# EAGLE schematic fitness logger (EAGLE 6.4)
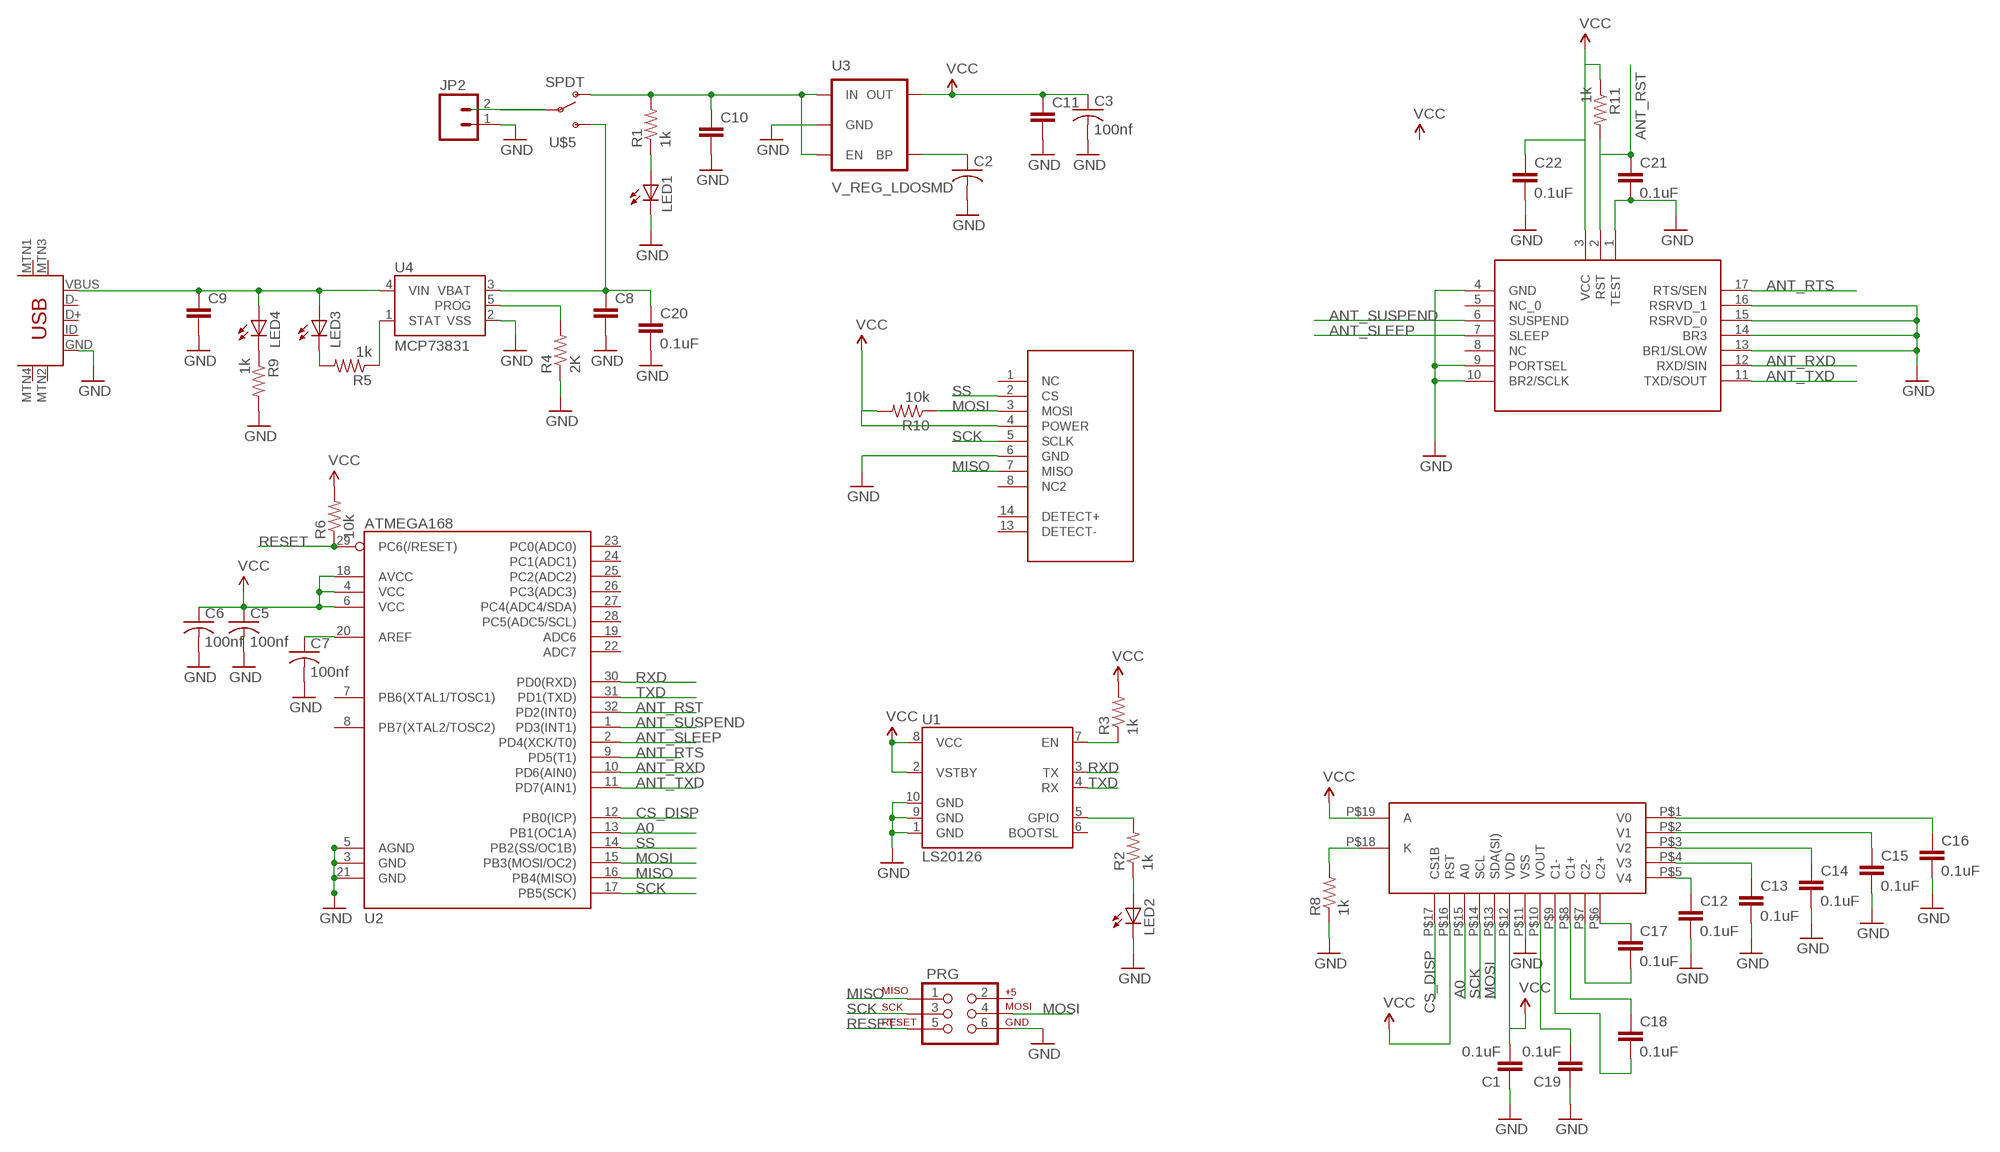
[diagram p0: schematic, sheet 1]

## Parts
C1  0.1uF  0.1UF-25V(+80/-20%)(0603)  [0402-CAP]
C2  C-USC0603  [C0603]
C3  100nf  C-USC0603  [C0603]
C5  100nf  C-USC0603  [C0603]
C6  100nf  C-USC0603  [C0603]
C7  100nf  C-USC0603  [C0603]
C8  CAP1210  [1210]
C9  CAP1210  [1210]
C10  CAP1210  [1210]
C11  CAP1210  [1210]
C12  0.1uF  0.1UF-25V(+80/-20%)(0603)  [0402-CAP]
C13  0.1uF  0.1UF-25V(+80/-20%)(0603)  [0402-CAP]
C14  0.1uF  0.1UF-25V(+80/-20%)(0603)  [0402-CAP]
C15  0.1uF  0.1UF-25V(+80/-20%)(0603)  [0402-CAP]
C16  0.1uF  0.1UF-25V(+80/-20%)(0603)  [0402-CAP]
C17  0.1uF  0.1UF-25V(+80/-20%)(0603)  [0402-CAP]
C18  0.1uF  0.1UF-25V(+80/-20%)(0603)  [0402-CAP]
C19  0.1uF  0.1UF-25V(+80/-20%)(0603)  [0402-CAP]
C20  0.1uF  0.1UF-25V(+80/-20%)(0603)  [0402-CAP]
C21  0.1uF  0.1UF-25V(+80/-20%)(0603)  [0402-CAP]
C22  0.1uF  0.1UF-25V(+80/-20%)(0603)  [0402-CAP]
JP2  M02PTH3  [1X02_LONGPADS]
LED1  LEDCHIPLED_0603  [CHIPLED_0603]
LED2  LEDCHIPLED_0603  [CHIPLED_0603]
LED3  LEDCHIPLED_0603  [CHIPLED_0603]
LED4  LEDCHIPLED_0603  [CHIPLED_0603]
PRG  AVR_SPI_PRG_6PTH  [2X3]
R1  1k  RESISTOR0603-RES  [0603-RES]
R2  1k  RESISTOR0603-RES  [0603-RES]
R3  1k  RESISTOR0603-RES  [0603-RES]
R4  2K  RESISTOR0603-RES  [0603-RES]
R5  1k  RESISTOR0603-RES  [0603-RES]
R6  10k  RESISTOR0603-RES  [0603-RES]
R8  1k  RESISTOR0603-RES  [0603-RES]
R9  1k  RESISTOR0603-RES  [0603-RES]
R10  10k  RESISTOR0603-RES  [0603-RES]
R11  1k  RESISTOR0603-RES  [0603-RES]
U1  LS20126  [LS20126]
U2  ATMEGA168  [TQFP32-08]
U3  V_REG_LDOSMD  [SOT23-5]
U4  MCP73831  [SOT23-5]
U$1  USB-MINIB-5PIN  [USB-MINIB]
U$2  ANTAP281M4IB  [ANTAP281M4IB]
U$3  NHD-C12832A1Z  [NHD-C12832A1Z]
U$4  MICRO_SD  [MICRO_SD_MOLEX]
U$5  SPDT  [SPDT-SMD]

## Nets
A0: U2.13(PB1(OC1A)) U$3.P$15(A0)
ANT_RST: C21.1 R11.2 U2.32(PD2(INT0)) U$2.2(RST)
ANT_RTS: U2.9(PD5(T1)) U$2.17(RTS/SEN)
ANT_RXD: U2.10(PD6(AIN0)) U$2.12(RXD/SIN)
ANT_SLEEP: U2.2(PD4(XCK/T0)) U$2.7(SLEEP)
ANT_SUSPEND: U2.1(PD3(INT1)) U$2.6(SUSPEND)
ANT_TXD: U2.11(PD7(AIN1)) U$2.11(TXD/SOUT)
CS_DISP: U2.12(PB0(ICP)) U$3.P$17(CS1B)
GND: C1.1 C2.2 C3.2 C5.2 C6.2 C7.2 C8.2 C9.2 C10.2 C11.2 C12.2 C13.2 C14.2 C15.2 C16.2 C19.1 C20.2 C21.2 C22.2 JP2.1 LED1.C LED2.C PRG.6 R4.1 R8.1 R9.2 U1.1(GND) U1.9(GND) U1.10(GND) U2.3(GND) U2.5(AGND) U2.21(GND) U3.2(GND) U4.2(VSS) U$1.GND U$2.1(TEST) U$2.4(GND) U$2.9(PORTSEL) U$2.10(BR2/SCLK) U$2.13(BR1/SLOW) U$2.14(BR3) U$2.15(RSRVD_0) U$2.16(RSRVD_1) U$3.P$11(VSS) U$4.6(GND)
MISO: PRG.1 U2.16(PB4(MISO)) U$4.7(MISO)
MOSI: PRG.4 R10.1 U2.15(PB3(MOSI/OC2)) U$3.P$13(SDA(SI)) U$4.3(MOSI)
N$1: C10.1 R1.2 U3.1(IN) U3.3(EN) U$5.1(O) U$5.4(O)
N$2: C2.1 U3.4(BP)
N$3: LED1.A R1.1
N$4: C9.1 LED3.A LED4.A U4.4(VIN) U$1.VBUS
N$5: LED2.A R2.1
N$6: R2.2 U1.5(GPIO)
N$7: JP2.2 U$5.2(P) U$5.5(P)
N$8: C8.1 C20.1 U4.3(VBAT) U$5.3(S) U$5.6(S)
N$9: R3.1 U1.7(EN)
N$11: R4.2 U4.5(PROG)
N$12: C7.1 U2.20(AREF)
N$13: LED3.C R5.2
N$14: R5.1 U4.1(STAT)
N$15: C12.1 U$3.P$5(V4)
N$16: C13.1 U$3.P$4(V3)
N$17: C14.1 U$3.P$3(V2)
N$18: C15.1 U$3.P$2(V1)
N$19: C16.1 U$3.P$1(V0)
N$20: C17.1 U$3.P$6(C2+)
N$21: C17.2 U$3.P$7(C2-)
N$22: C19.2 U$3.P$10(VOUT)
N$23: C18.1 U$3.P$8(C1+)
N$24: R8.2 U$3.P$18(K)
N$25: C18.2 U$3.P$9(C1-)
N$26: LED4.C R9.1
RESET: PRG.5 R6.1 U2.29(PC6(/RESET))
RXD: U1.3(TX) U2.30(PD0(RXD))
SCK: PRG.3 U2.17(PB5(SCK)) U$3.P$14(SCL) U$4.5(SCLK)
SS: U2.14(PB2(SS/OC1B)) U$4.2(CS)
TXD: U1.4(RX) U2.31(PD1(TXD))
VCC: C1.2 C3.1 C5.1 C6.1 C11.1 C22.1 R3.2 R6.2 R10.2 R11.1 U1.2(VSTBY) U1.8(VCC) U2.4(VCC) U2.6(VCC) U2.18(AVCC) U3.5(OUT) U$2.3(VCC) U$3.P$12(VDD) U$3.P$16(RST) U$3.P$19(A) U$4.4(POWER)
Unconnected: PRG.2 U1.6(BOOTSL) U2.7(PB6(XTAL1/TOSC1)) U2.8(PB7(XTAL2/TOSC2)) U2.19(ADC6) U2.22(ADC7) U2.23(PC0(ADC0)) U2.24(PC1(ADC1)) U2.25(PC2(ADC2)) U2.26(PC3(ADC3)) U2.27(PC4(ADC4/SDA)) U2.28(PC5(ADC5/SCL)) U$1.D+ U$1.D- U$1.ID U$1.MTN1(MTN2) U$1.MTN2(MTN3) U$1.MTN3(MTN1) U$1.MTN4 U$2.5(NC_0) U$2.8(NC) U$4.1(NC) U$4.8(NC2) U$4.13(DETECT-) U$4.14(DETECT+)

## Library data of the parts
C1 C12-C22 = SparkFun-Capacitors:0.1UF-25V(+80/-20%)(0603): Ceramic Standard decoupling cap CAP-00810; PROD_ID: CAP-00810
C2 C3 C5-C7 = rcl:C-US: CAPACITOR, American symbol
C8-C11 = SparkFun-Passives:CAP: Capacitor Standard 0603 ceramic capacitor, and 0.1" leaded capacitor.
JP2 = SparkFun-Connectors:M02: Header 2 Standard 2-pin 0.1" header. Use with straight break away headers (SKU : PRT-00116), right angle break away headers (PRT-00553), swiss pins (PRT-00743), machine pins (PRT-00117), and female headers (PRT-00115). Molex polarized connector foot print use with SKU : PRT-08233 with associated crimp pins and housings.
LED1-LED4 = led:LED: LED OSRAM: - CHIPLED LG R971, LG N971, LY N971, LG Q971, LY Q971, LO R971, LY R971 LH N974, LH R974 LS Q976, LO Q976, LY Q976 LO Q996 - Hyper CHIPLED LW Q18S LB Q993, LB Q99A, LB R99A - SideLED LS A670, LO A670, LY A670, LG A670, LP A670 LB A673, LV A673, LT A673, LW A673 LH A674 LY A675 LS A676, LA A676, LO A676, LY A676, LW A676 LS A679, LY A679, LG A679 - Hyper Micro SIDELED® LS Y876, LA Y876, LO Y876, LY Y876 LT Y87S - SmartLED LW L88C, LW L88S LB L89C, LB L89S, LG L890 LS L89K, LO L89K, LY L89K LS L896, LA L896, LO L896, LY L896 - TOPLED LS T670, LO T670, LY T670, LG T670, LP T670 LSG T670, LSP T670, LSY T670, LOP T670, LYG T670 LG T671, LOG T671, LSG T671 LB T673, LV T673, LT T673, LW T673 LH T674 LS T676, LA T676, LO T676, LY T676, LB T676, LH T676, LSB T676, LW T676 LB T67C, LV T67C, LT T67C, LS T67K, LO T67K, LY T67K, LW E67C LS E67B, LA E67B, LO E67B, LY E67B, LB E67C, LV E67C, LT E67C LW T67C LS T679, LY T679, LG T679 LS T770, LO T770, LY T770, LG T770, LP T770 LB T773, LV T773, LT T773, LW T773 LH T774 LS E675, LA E675, LY E675, LS T675 LS T776, LA T776, LO T776, LY T776, LB T776 LHGB T686 LT T68C, LB T68C - Hyper Mini TOPLED® LB M676 - Mini TOPLED Santana® LG M470 LS M47K, LO M47K, LY M47K Source: http://www.osram.convergy.de LUXEON: - LUMILED® LXK2-PW12-R00, LXK2-PW12-S00, LXK2-PW14-U00, LXK2-PW14-V00 LXK2-PM12-R00, LXK2-PM12-S00, LXK2-PM14-U00 LXK2-PE12-Q00, LXK2-PE12-R00, LXK2-PE12-S00, LXK2-PE14-T00, LXK2-PE14-U00 LXK2-PB12-K00, LXK2-PB12-L00, LXK2-PB12-M00, LXK2-PB14-N00, LXK2-PB14-P00, LXK2-PB14-Q00 LXK2-PR12-L00, LXK2-PR12-M00, LXK2-PR14-Q00, LXK2-PR14-R00 LXK2-PD12-Q00, LXK2-PD12-R00, LXK2-PD12-S00 LXK2-PH12-R00, LXK2-PH12-S00 LXK2-PL12-P00, LXK2-PL12-Q00, LXK2-PL12-R00 Source: www.luxeon.com KINGBRIGHT: KA-3528ASYC Source: www.kingbright.com
PRG = SparkFun:AVR_SPI_PRG_6: AVR ISP 6 Pin This is the reduced ISP connector for AVR programming. Common on Arduino. This footprint will take up less PCB space and can be used with a 10-pin to 6-pin adapter such as SKU: BOB-08508
R1-R6 R8-R11 = SparkFun:RESISTOR: Resistor Basic schematic elements and footprints for 0603, 1206, and PTH resistors.
U1 = SparkFun:LS20126: LS20126 20-Channel GPS Module SparkFun SKU# GPS-09838 The LOCOSYS LS20126 GPS smart antenna module is a high sensitivity, low power, SMD type, 20 channels with built-in magnetic sensor, 3-axial acceleration sensor L1 GPS receiver and 10mm patch antenna designed for portable applications.
U2 = SparkFun:ATMEGA168
U3 = SparkFun:V_REG_LDO: Voltage Regulator LDO Standard 150mA LDO voltage regulator in SOT-23 layout. Micrel part MIC5205. BP (by-pass) pin is used to lower output noise with 470pF cap.
U4 = SparkFun-PowerIC:MCP73831: Miniature single cell, fully integrated Li-Ion, Li-polymer charge management controller http://ww1.microchip.com/downloads/en/DeviceDoc/21984a.pdf IC-09995; PROD_ID: IC-09995
U$1 = SparkFun-Connectors:USB-MINIB: Mini-USB "B" connector with 5th pin broken out. Created new symbol breaking out 5th "ID" pin in mini/micro USB connector spec. See: http://en.wikipedia.org/wiki/Mini_usb#Cables. Uses same footprint as 4-pin symbol. Also added pins to connect to mounting / shield pads if required (probably not generally needed as signals aren't shielded once they leave the connector).
U$2 = RF:ANTAP281M4IB
U$3 = displays:NHD-C12832A1Z
U$4 = connectors:MICRO_SD
U$5 = switches:SPDT